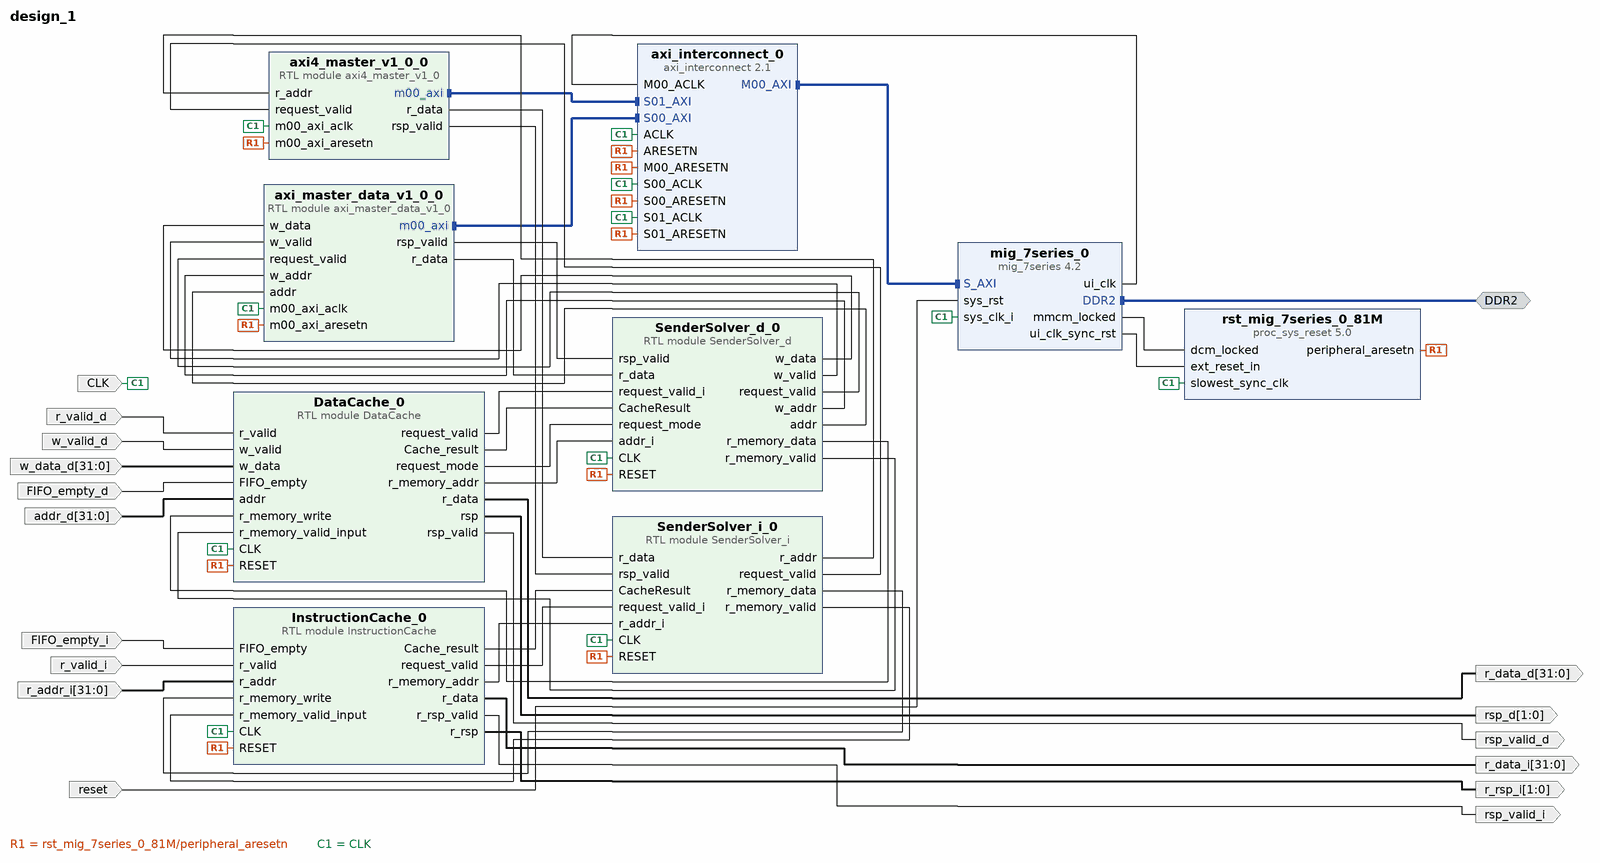
[diagram p0: block diagram of the top level]
# Vivado block design design_1, xc7a100tcsg324-1, Vivado 2019.1.3
create_bd_design design_1

create_bd_intf_port -mode Master -vlnv xilinx.com:interface:ddrx_rtl:1.0 DDR2
create_bd_port -dir I -type rst reset
set_property -dict {CONFIG.POLARITY ACTIVE_LOW} [get_bd_ports reset]
create_bd_port -dir I -type clk CLK
set_property -dict {CONFIG.FREQ_HZ 200000000} [get_bd_ports CLK]
create_bd_port -dir I r_valid_d
create_bd_port -dir I w_valid_d
create_bd_port -dir I -from 31 -to 0 w_data_d
create_bd_port -dir I FIFO_empty_d
create_bd_port -dir I -from 31 -to 0 addr_d
create_bd_port -dir I r_valid_i
create_bd_port -dir I -from 31 -to 0 r_addr_i
create_bd_port -dir I FIFO_empty_i
create_bd_port -dir O -from 31 -to 0 r_data_d
create_bd_port -dir O rsp_valid_d
create_bd_port -dir O -from 1 -to 0 rsp_d
create_bd_port -dir O -from 31 -to 0 r_data_i
create_bd_port -dir O -from 1 -to 0 r_rsp_i
create_bd_port -dir O rsp_valid_i

create_bd_cell -type ip -vlnv xilinx.com:ip:axi_interconnect:2.1 axi_interconnect_0
set_property -dict {CONFIG.NUM_MI 1 CONFIG.NUM_SI 2} [get_bd_cells axi_interconnect_0]
create_bd_cell -type ip -vlnv xilinx.com:ip:mig_7series:4.2 mig_7series_0
set_property -dict [list \
  CONFIG.BOARD_MIG_PARAM Custom \
  CONFIG.RESET_BOARD_INTERFACE reset \
  CONFIG.XML_INPUT_FILE mig_a.prj \
] [get_bd_cells mig_7series_0]
create_bd_cell -type module -reference SenderSolver_i SenderSolver_i_0
create_bd_cell -type module -reference InstructionCache InstructionCache_0
create_bd_cell -type module -reference axi4_master_v1_0 axi4_master_v1_0_0
create_bd_cell -type module -reference SenderSolver_d SenderSolver_d_0
create_bd_cell -type module -reference axi_master_data_v1_0 axi_master_data_v1_0_0
create_bd_cell -type ip -vlnv xilinx.com:ip:proc_sys_reset:5.0 rst_mig_7series_0_81M
create_bd_cell -type module -reference DataCache DataCache_0

# ---- connections ----

connect_bd_intf_net [get_bd_intf_pins axi_master_data_v1_0_0/m00_axi] [get_bd_intf_pins axi_interconnect_0/S00_AXI]
connect_bd_intf_net [get_bd_intf_ports DDR2] [get_bd_intf_pins mig_7series_0/DDR2]
connect_bd_intf_net [get_bd_intf_pins axi4_master_v1_0_0/m00_axi] [get_bd_intf_pins axi_interconnect_0/S01_AXI]
connect_bd_intf_net [get_bd_intf_pins axi_interconnect_0/M00_AXI] [get_bd_intf_pins mig_7series_0/S_AXI]
connect_bd_net [get_bd_pins InstructionCache_0/Cache_result] [get_bd_pins SenderSolver_i_0/CacheResult]
connect_bd_net [get_bd_pins InstructionCache_0/request_valid] [get_bd_pins SenderSolver_i_0/request_valid_i]
connect_bd_net [get_bd_pins InstructionCache_0/r_memory_addr] [get_bd_pins SenderSolver_i_0/r_addr_i]
connect_bd_net [get_bd_pins SenderSolver_i_0/r_memory_data] [get_bd_pins InstructionCache_0/r_memory_write]
connect_bd_net [get_bd_pins SenderSolver_i_0/r_memory_valid] [get_bd_pins InstructionCache_0/r_memory_valid_input]
connect_bd_net [get_bd_pins SenderSolver_i_0/r_addr] [get_bd_pins axi4_master_v1_0_0/r_addr]
connect_bd_net [get_bd_pins SenderSolver_i_0/request_valid] [get_bd_pins axi4_master_v1_0_0/request_valid]
connect_bd_net [get_bd_pins axi4_master_v1_0_0/r_data] [get_bd_pins SenderSolver_i_0/r_data]
connect_bd_net [get_bd_pins axi4_master_v1_0_0/rsp_valid] [get_bd_pins SenderSolver_i_0/rsp_valid]
connect_bd_net [get_bd_pins DataCache_0/request_valid] [get_bd_pins SenderSolver_d_0/request_valid_i]
connect_bd_net [get_bd_pins DataCache_0/Cache_result] [get_bd_pins SenderSolver_d_0/CacheResult]
connect_bd_net [get_bd_pins DataCache_0/request_mode] [get_bd_pins SenderSolver_d_0/request_mode]
connect_bd_net [get_bd_pins SenderSolver_d_0/r_memory_data] [get_bd_pins DataCache_0/r_memory_write]
connect_bd_net [get_bd_pins SenderSolver_d_0/r_memory_valid] [get_bd_pins DataCache_0/r_memory_valid_input]
connect_bd_net [get_bd_pins DataCache_0/r_memory_addr] [get_bd_pins SenderSolver_d_0/addr_i]
connect_bd_net [get_bd_pins SenderSolver_d_0/w_data] [get_bd_pins axi_master_data_v1_0_0/w_data]
connect_bd_net [get_bd_pins SenderSolver_d_0/w_valid] [get_bd_pins axi_master_data_v1_0_0/w_valid]
connect_bd_net [get_bd_pins SenderSolver_d_0/request_valid] [get_bd_pins axi_master_data_v1_0_0/request_valid]
connect_bd_net [get_bd_pins SenderSolver_d_0/w_addr] [get_bd_pins axi_master_data_v1_0_0/w_addr]
connect_bd_net [get_bd_pins SenderSolver_d_0/addr] [get_bd_pins axi_master_data_v1_0_0/addr]
connect_bd_net [get_bd_pins axi_master_data_v1_0_0/rsp_valid] [get_bd_pins SenderSolver_d_0/rsp_valid]
connect_bd_net [get_bd_pins axi_master_data_v1_0_0/r_data] [get_bd_pins SenderSolver_d_0/r_data]
connect_bd_net [get_bd_pins mig_7series_0/mmcm_locked] [get_bd_pins rst_mig_7series_0_81M/dcm_locked]
connect_bd_net [get_bd_pins mig_7series_0/ui_clk_sync_rst] [get_bd_pins rst_mig_7series_0_81M/ext_reset_in]
connect_bd_net [get_bd_pins rst_mig_7series_0_81M/peripheral_aresetn] \
  [get_bd_pins axi_interconnect_0/ARESETN] [get_bd_pins axi_interconnect_0/S00_ARESETN] \
  [get_bd_pins axi_master_data_v1_0_0/m00_axi_aresetn] [get_bd_pins axi_interconnect_0/M00_ARESETN] \
  [get_bd_pins axi_interconnect_0/S01_ARESETN] [get_bd_pins axi4_master_v1_0_0/m00_axi_aresetn] \
  [get_bd_pins SenderSolver_i_0/RESET] [get_bd_pins InstructionCache_0/RESET] [get_bd_pins SenderSolver_d_0/RESET] \
  [get_bd_pins DataCache_0/RESET]
connect_bd_net [get_bd_ports reset] [get_bd_pins mig_7series_0/sys_rst]
connect_bd_net [get_bd_ports r_valid_d] [get_bd_pins DataCache_0/r_valid]
connect_bd_net [get_bd_ports w_valid_d] [get_bd_pins DataCache_0/w_valid]
connect_bd_net [get_bd_ports w_data_d] [get_bd_pins DataCache_0/w_data]
connect_bd_net -net FIFO_empty_1 [get_bd_ports FIFO_empty_d] [get_bd_pins DataCache_0/FIFO_empty]
connect_bd_net [get_bd_ports addr_d] [get_bd_pins DataCache_0/addr]
connect_bd_net [get_bd_ports FIFO_empty_i] [get_bd_pins InstructionCache_0/FIFO_empty]
connect_bd_net [get_bd_ports r_valid_i] [get_bd_pins InstructionCache_0/r_valid]
connect_bd_net [get_bd_ports r_addr_i] [get_bd_pins InstructionCache_0/r_addr]
connect_bd_net [get_bd_pins DataCache_0/r_data] [get_bd_ports r_data_d]
connect_bd_net [get_bd_pins DataCache_0/rsp] [get_bd_ports rsp_d]
connect_bd_net [get_bd_pins DataCache_0/rsp_valid] [get_bd_ports rsp_valid_d]
connect_bd_net [get_bd_pins InstructionCache_0/r_data] [get_bd_ports r_data_i]
connect_bd_net [get_bd_pins InstructionCache_0/r_rsp_valid] [get_bd_ports rsp_valid_i]
connect_bd_net [get_bd_pins InstructionCache_0/r_rsp] [get_bd_ports r_rsp_i]
connect_bd_net [get_bd_ports CLK] \
  [get_bd_pins axi_interconnect_0/ACLK] [get_bd_pins axi_interconnect_0/S00_ACLK] \
  [get_bd_pins axi_master_data_v1_0_0/m00_axi_aclk] [get_bd_pins axi_interconnect_0/S01_ACLK] \
  [get_bd_pins axi4_master_v1_0_0/m00_axi_aclk] [get_bd_pins InstructionCache_0/CLK] [get_bd_pins SenderSolver_i_0/CLK] \
  [get_bd_pins SenderSolver_d_0/CLK] [get_bd_pins mig_7series_0/sys_clk_i] \
  [get_bd_pins rst_mig_7series_0_81M/slowest_sync_clk] [get_bd_pins DataCache_0/CLK]
connect_bd_net [get_bd_pins mig_7series_0/ui_clk] [get_bd_pins axi_interconnect_0/M00_ACLK]

validate_bd_design
save_bd_design
